# Altium schematic sheet ScopeDefl.SchDoc: Electrostatic CRT Deflection & Video Amp
size Letter; Organization: ES; Revision: A; SheetNumber: 1; SheetTotal: 1
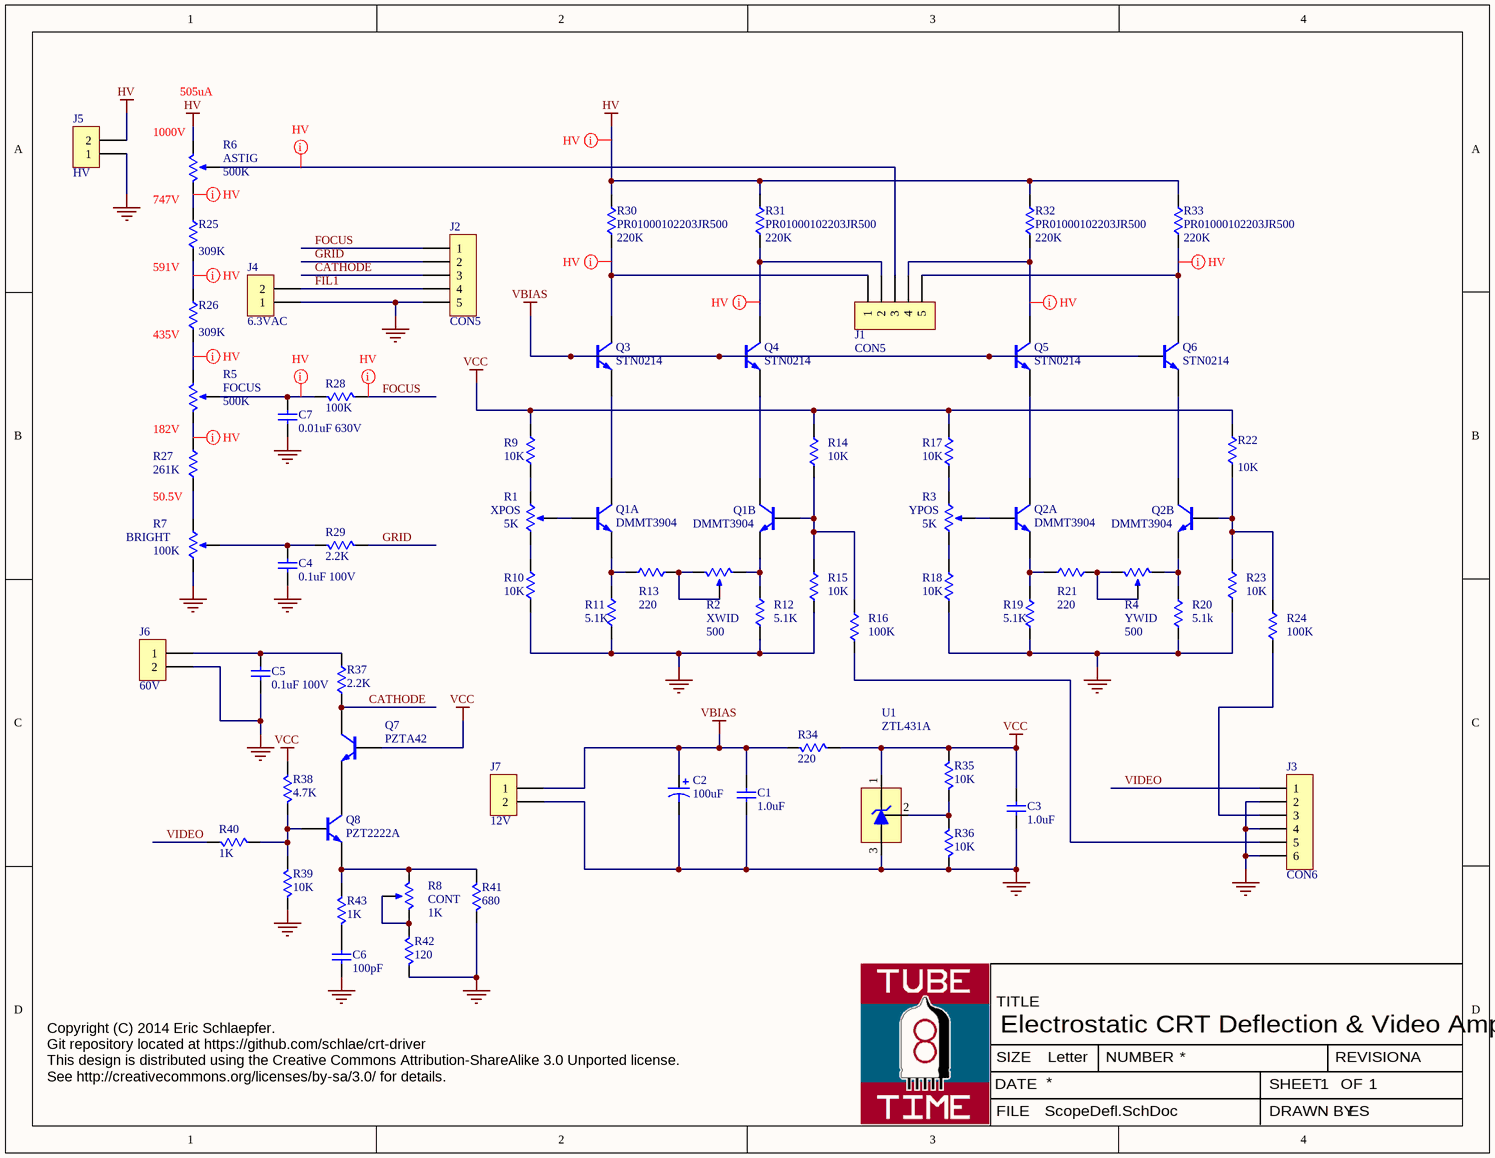
[diagram p0: ScopeDefl.SchDoc]

## Parts
C1  value 1.0uF  [G_0805[2012]]  (hidden comment: Cap)
C2  value 100uF  [CAP_R100x250]  (hidden comment: Cap Pol2)
C3  value 1.0uF  [G_0805[2012]]  (hidden comment: Cap)
C4  value 0.1uF 100V  [G_1206[3216]]  (hidden comment: Cap)
C5  value 0.1uF 100V  [G_1206[3216]]  (hidden comment: Cap)
C6  value 100pF  [G_0805[2012]]  (hidden comment: Cap)
C7  value 0.01uF 630V  [G_1206[3216]]  (hidden comment: Cap)
J1  CON5  [HDR5S156]
J2  CON5  [HDR5S156]
J3  CON6  [HDR6S]
J4  6.3VAC  [HDR2S156]
J5  HV  [HDR3S156M1]
J6  60V  [HDR2S]
J7  12V  [HDR2S]
Q1  DMMT3904  [G_SC70]  (parts A,B of 2)
Q2  DMMT3904  [G_SC70]  (parts A,B of 2)
Q3  STN0214  [G_SOT223TNC]
Q4  STN0214  [G_SOT223TNC]
Q5  STN0214  [G_SOT223TNC]
Q6  STN0214  [G_SOT223TNC]
Q7  value PZTA42  [G_SOT223T]  (hidden comment: NPN)
Q8  value PZT2222A  [G_SOT223T]  (hidden comment: NPN)
R1  XPOS  value 5K  [POT_TRIM BOURNS 3386F]
R2  XWID  value 500  [POT_TRIM BOURNS 3386F]
R3  YPOS  value 5K  [POT_TRIM BOURNS 3386F]
R4  YWID  value 500  [POT_TRIM BOURNS 3386F]
R5  FOCUS  value 500K  [POT_TRIM BOURNS 3386F]
R6  ASTIG  value 500K  [POT_TRIM BOURNS 3386F]
R7  BRIGHT  value 100K  [POT_TRIM BOURNS 3386F]
R8  CONT  value 1K  [POT_TRIM BOURNS 3386F]
R9  value 10K  [G_0805[2012]]  (hidden comment: Res1)
R10  value 10K  [G_0805[2012]]  (hidden comment: Res1)
R11  value 5.1K  [G_0805[2012]]  (hidden comment: Res1)
R12  value 5.1K  [G_0805[2012]]  (hidden comment: Res1)
R13  value 220  [G_0805[2012]]  (hidden comment: Res1)
R14  value 10K  [G_0805[2012]]  (hidden comment: Res1)
R15  value 10K  [G_0805[2012]]  (hidden comment: Res1)
R16  value 100K  [G_0805[2012]]  (hidden comment: Res1)
R17  value 10K  [G_0805[2012]]  (hidden comment: Res1)
R18  value 10K  [G_0805[2012]]  (hidden comment: Res1)
R19  value 5.1K  [G_0805[2012]]  (hidden comment: Res1)
R20  value 5.1k  [G_0805[2012]]  (hidden comment: Res1)
R21  value 220  [G_0805[2012]]  (hidden comment: Res1)
R22  value 10K  [G_0805[2012]]  (hidden comment: Res1)
R23  value 10K  [G_0805[2012]]  (hidden comment: Res1)
R24  value 100K  [G_0805[2012]]  (hidden comment: Res1)
R25  value 309K  [G_1206[3216]]  (hidden comment: Res1)
R26  value 309K  [G_1206[3216]]  (hidden comment: Res1)
R27  value 261K  [G_1206[3216]]  (hidden comment: Res1)
R28  value 100K  [G_0805[2012]]  (hidden comment: Res1)
R29  value 2.2K  [G_0805[2012]]  (hidden comment: Res1)
R30  PR01000102203JR500  value 220K  [RES450X100]
R31  PR01000102203JR500  value 220K  [RES450X100]
R32  PR01000102203JR500  value 220K  [RES450X100]
R33  PR01000102203JR500  value 220K  [RES450X100]
R34  value 220  [G_0805[2012]]  (hidden comment: Res1)
R35  value 10K  [G_0805[2012]]  (hidden comment: Res1)
R36  value 10K  [G_0805[2012]]  (hidden comment: Res1)
R37  value 2.2K  [G_1206[3216]]  (hidden comment: Res1)
R38  value 4.7K  [G_0805[2012]]  (hidden comment: Res1)
R39  value 10K  [G_0805[2012]]  (hidden comment: Res1)
R40  value 1K  [G_0805[2012]]  (hidden comment: Res1)
R41  value 680  [G_0805[2012]]  (hidden comment: Res1)
R42  value 120  [G_0805[2012]]  (hidden comment: Res1)
R43  value 1K  [G_0805[2012]]  (hidden comment: Res1)
U1  ZTL431A  [G_SOT23]

## Nets
GND: C1.1 C2.2 C3.1 C4.2 C5.2 C6.2 C7.2 J2.5 J3.2 J3.4 J3.6 J4.1 J5.1 J6.2 J7.2 R7.1(TOP) R10.1 R11.1 R12.1 R15.2 R18.2 R19.2 R20.2 R23.1 R36.2 R39.2 R41.2 R42.2 U1.3(A)
HV: J5.2 R6.1(TOP) R30.2 R31.2 R32.2 R33.2
VBIAS: C1.2 C2.1 J7.1 Q3.B Q4.B Q5.B Q6.B R34.2
VCC: C3.2 Q7.B R9.2 R14.1 R17.1 R22.2 R34.1 R35.1 R38.1 U1.1(C)
CATHODE: J2.3 Q7.C R37.1
FIL1: J2.4 J4.2
FOCUS: J2.1 R28.1
GRID: J2.2 R29.1
VIDEO: J3.1 R40.1
NetC4_1: C4.1 R7.3(TAP) R29.2
NetC5_1: C5.1 J6.1 R37.2
NetC6_1: C6.1 R43.2
NetC7_1: C7.1 R5.3(TAP) R28.2
NetJ1_1: J1.1 Q3.C R30.1
NetJ1_2: J1.2 Q4.C R31.1
NetJ1_3: J1.3 R6.3(TAP)
NetJ1_4: J1.4 Q5.C R32.1
NetJ1_5: J1.5 Q6.C R33.1
NetJ3_3: J3.3 R24.1
NetJ3_5: J3.5 R16.2
NetQ1_1: Q1.1(B2) R14.2 R15.1 R16.1
NetQ1_2: Q1.2(B1) R1.3(TAP)
NetQ1_3: Q1.3(C1) Q3.E
NetQ1_4: Q1.4(E1) R11.2 R13.2
NetQ1_5: Q1.5(E2) R2.1(TOP) R12.2
NetQ1_6: Q1.6(C2) Q4.E
NetQ2_1: Q2.1(B2) R22.1 R23.2 R24.2
NetQ2_2: Q2.2(B1) R3.3(TAP)
NetQ2_3: Q2.3(C1) Q5.E
NetQ2_4: Q2.4(E1) R19.1 R21.1
NetQ2_5: Q2.5(E2) R4.1(TOP) R20.1
NetQ2_6: Q2.6(C2) Q6.E
NetQ7_E: Q7.E Q8.C
NetQ8_B: Q8.B R38.2 R39.1 R40.2
NetQ8_E: Q8.E R8.2(BOT) R41.1 R43.1
NetR1_1: R1.1(TOP) R10.2
NetR1_2: R1.2(BOT) R9.1
NetR2_2: R2.2(BOT) R2.3(TAP) R13.1
NetR3_1: R3.1(TOP) R18.1
NetR3_2: R3.2(BOT) R17.2
NetR4_2: R4.2(BOT) R4.3(TAP) R21.2
NetR5_1: R5.1(TOP) R26.1
NetR5_2: R5.2(BOT) R27.2
NetR6_2: R6.2(BOT) R25.2
NetR7_2: R7.2(BOT) R27.1
NetR8_1: R8.1(TOP) R8.3(TAP) R42.1
NetR25_1: R25.1 R26.2
NetR35_2: R35.2 R36.1 U1.2(REF)

## Layout directives
net class HV: FOCUS, HV, NetC7_1, NetJ1_1, NetJ1_2, NetJ1_3, NetJ1_4, NetJ1_5, NetR5_1, NetR5_2, NetR6_2, NetR25_1

## Notes on the sheet
- 505uA
- (near R6) 1000V
- 747V
- 591V
- (near R26) 435V
- 182V
- 50.5V
- Copyright (C) 2014 Eric Schlaepfer.
  Git repository located at https://github.com/schlae/crt-driver
  This design is distributed using the Creative Commons Attribution-ShareAlike 3.0 Unported license.
  See http://creativecommons.org/licenses/by-sa/3.0/ for details.
- TITLE
- DATE
- SIZE
- Letter
- NUMBER
- SHEET
- REVISION
- OF
- FILE
- DRAWN BY

## Library data of the parts
C1 C3 = Cap: Capacitor; ManufPart: C2012X7R1E105K125AB; Mouser: 810-C2012X7R1E105K
C2 = CapP: Polarized Capacitor; ManufPart: UVR1E101MED1TD; Mouser: 647-UVR1E101MED1TD
C4-C7 = Cap: Capacitor
  C4 C5: Mouser: 810-C3216X7R2A104K
  C6: Mouser: 581-08055A101J
  C7: Mouser: 810-C3216X7R2J103K
J1 J2 = CON5: Connector, 5 pin; Mouser: 538-26-48-1051
J3 = CON6: Connector, 5 pin; Mouser: 538-42375-1863
J4-J7 = CON2: Connector, 2 pin
  J4: Mouser: 538-26-48-1021
  J5: Mouser: 538-26-48-1031
  J6 J7: Mouser: Part of J3
Q1 Q2 = NPN_DUAL2: NPN Dual Bipolar Transistor; ManufPart: DMMT3904W-7-F; Mouser: 621-DMMT3904W-F
Q3-Q6 = NPN: NPN Bipolar Transistor; ManufPart: 511-STN0214; Mouser: 511-STN0214
Q7 Q8 = NPN: NPN Bipolar Transistor
  Q7: ManufPart: PZTA42; Mouser: 512-PZTA42
  Q8: ManufPart: PZT2222A; Mouser: 512-PZT2222A
R1 R3 = Pot: Variable Resistor; ManufPart: 3386F-1-502LF; Mouser: 652-3386F-1-502LF
R2 R4 = Pot: Variable Resistor; ManufPart: 3386F-1-501LF; Mouser: 652-3386F-1-501LF
R5 R6 = Pot: Variable Resistor; ManufPart: 3386F-1-504LF; Mouser: 652-3386F-1-504LF
R7 = Pot: Variable Resistor; ManufPart: 3386F-1-104LF; Mouser: 652-3386F-1-104LF
R8 = Pot: Variable Resistor; ManufPart: 3386F-1-102LF; Mouser: 652-3386F-1-102LF
R9 R10 R14 R15 R17 R18 R22 R23 R35 R36 R39 = Res: Resistor; ManufPart: CRCW080510K0FKEB; Mouser: 71-CRCW080510K0FKEB
R11 R12 R19 R20 = Res: Resistor; ManufPart: CRCW08055K10FKEA; Mouser: 71-CRCW0805-5.1K-E3
R13 R21 R34 = Res: Resistor; ManufPart: CRCW0805220RFKEA; Mouser: 71-CRCW0805-220-E3
R16 R24 R28 = Res: Resistor; ManufPart: CRCW0805100KFKEA; Mouser: 71-CRCW0805-100K-E3
R25 R26 = Res: Resistor; ManufPart: ERJ-8ENF3093V; Mouser: 667-ERJ-8ENF3093V
R27 = Res: Resistor; ManufPart: CRCW1206261KFKEA; Mouser: 71-CRCW1206-261K-E3
R29 = Res: Resistor; ManufPart: ERJ-6ENF2201V; Mouser: 667-ERJ-6ENF2201V
R30-R33 = Res: Resistor; ManufPart: PR01000102203JR500; Mouser: 594-5073NW220K0J
R37 = Res: Resistor; ManufPart: CRCW12062K20FKEA; Mouser: 71-CRCW1206-2.2K-E3
R38 = Res: Resistor; ManufPart: CRCW08054K70FKEA; Mouser: 71-CRCW0805-4.7K-E3
R40 R43 = Res: Resistor; ManufPart: CRCW08051K00JNEA; Mouser: 71-CRCW0805J-1K-E3
R41 = Res: Resistor; ManufPart: CRCW0805680RFKEA; Mouser: 71-CRCW0805680RFKEA
R42 = Res: Resistor; ManufPart: CRCW0805120RFKEA; Mouser: 71-CRCW0805120RFKEA
U1 = TL431: Adjustable Shunt Reg; ManufPart: ZTL431AFFTA; Mouser: 522-ZTL431AFTA